# Altium schematic sheet Bus UART.SchDoc
size A4
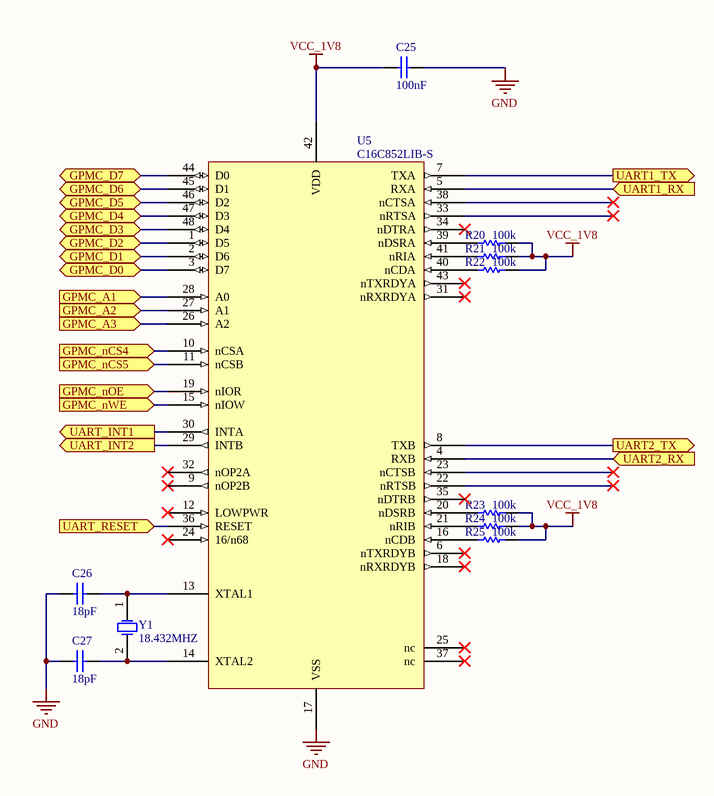
[diagram p0: Bus UART.SchDoc]

## Parts
C25  100nF  [0603]
C26  18pF  [0603]
C27  18pF  [0603]
R20  100k  [0603]
R21  100k  [0603]
R22  100k  [0603]
R23  100k  [0603]
R24  100k  [0603]
R25  100k  [0603]
U5  C16C852LIB-S  [LQFP-48]
Y1  18.432MHZ  [ConWin_Xtal]

## Ports
GPMC_A1 (in), GPMC_A2 (in), GPMC_A3 (in), GPMC_D0 (bidir), GPMC_D1 (bidir), GPMC_D2 (bidir), GPMC_D3 (bidir), GPMC_D4 (bidir), GPMC_D5 (bidir), GPMC_D6 (bidir), GPMC_D7 (bidir), GPMC_nCS4 (in), GPMC_nCS5 (in), GPMC_nOE (in), GPMC_nWE (in), UART1_RX (in), UART1_TX (out), UART2_RX (in), UART2_TX (out), UART_INT1 (out), UART_INT2 (out), UART_RESET (in)

## Nets
GND: C25.1 C26.1 C27.1 U5.17(VSS)
VCC_1V8: C25.2 R20.2 R21.2 R22.2 R23.2 R24.2 R25.2 U5.42(VDD)
GPMC_A1: U5.28(A0) ; port GPMC_A1
GPMC_A2: U5.27(A1) ; port GPMC_A2
GPMC_A3: U5.26(A2) ; port GPMC_A3
GPMC_D0: U5.3(D7) ; port GPMC_D0
GPMC_D1: U5.2(D6) ; port GPMC_D1
GPMC_D2: U5.1(D5) ; port GPMC_D2
GPMC_D3: U5.48(D4) ; port GPMC_D3
GPMC_D4: U5.47(D3) ; port GPMC_D4
GPMC_D5: U5.46(D2) ; port GPMC_D5
GPMC_D6: U5.45(D1) ; port GPMC_D6
GPMC_D7: U5.44(D0) ; port GPMC_D7
GPMC_nCS4: U5.10(nCSA) ; port GPMC_nCS4
GPMC_nCS5: U5.11(nCSB) ; port GPMC_nCS5
GPMC_nOE: U5.19(nIOR) ; port GPMC_nOE
GPMC_nWE: U5.15(nIOW) ; port GPMC_nWE
UART1_RX: U5.5(RXA) ; port UART1_RX
UART1_TX: U5.7(TXA) ; port UART1_TX
UART2_RX: U5.4(RXB) ; port UART2_RX
UART2_TX: U5.8(TXB) ; port UART2_TX
UART_INT1: U5.30(INTA) ; port UART_INT1
UART_INT2: U5.29(INTB) ; port UART_INT2
UART_RESET: U5.36(RESET) ; port UART_RESET
NetC26_2: C26.2 U5.13(XTAL1) Y1.1(OSC1)
NetC27_2: C27.2 U5.14(XTAL2) Y1.2(OSC2)
NetR20_1: R20.1 U5.39(nDSRA)
NetR21_1: R21.1 U5.41(nRIA)
NetR22_1: R22.1 U5.40(nCDA)
NetR23_1: R23.1 U5.20(nDSRB)
NetR24_1: R24.1 U5.21(nRIB)
NetR25_1: R25.1 U5.16(nCDB)

Not connected (* = marked no-connect by the designer): U5 6(nTXRDYB)* 9(nOP2B)* 12(LOWPWR)* 18(nRXRDYB)* 22(nRTSB)* 23(nCTSB)* 24(16/n68)* 25(nc)* 31(nRXRDYA)* 32(nOP2A)* 33(nRTSA)* 34(nDTRA)* 35(nDTRB)* 37(nc)* 38(nCTSA)* 43(nTXRDYA)*

## Library data of the parts
C25 = CP_100nF 0603: CAP CER .10UF 50V X5R 0603; Manufacturer: Taiyo Yuden; Manufacturer PN: UMK107B7104KA-T; Prototype: Digikey 587-1243-1-ND; LatestRevisionDate: 29 May 08; Value: 100nF
C26 C27 = CP_18pF 0603: CAP CER 18PF 50V 5% C0G 0603; Manufacturer: Murata Electronics North America; Manufacturer PN: GRM1885C1H180JA01D; Prototype: Digikey 490-1409-1-ND; LatestRevisionDate: 1 Jun 08; Value: 18pF
R20-R25 = RS_100k 0603: RES 100K OHM 1/10W 1% 0603 SMD; Manufacturer: Yageo; Manufacturer PN: RC0603FR-07100KL; Prototype: DigiKey 311-100KHRCT-ND; LatestRevisionDate: 1 Jun 08; Value: 100k
U5 = IC_SC16C852LIB-S: Dual high speed UARTs, bus connected
Y1 = XT_18.432MHZ: CRYSTAL 18.432MHZ LOW PRO SMD; Manufacturer PN: XL-1C-18.4320; Manufacturer: Connor-Winfield; Prototype: Digikey CW404-ND; LatestRevisionDate: 29 May 08; Value: 18.432MHZ